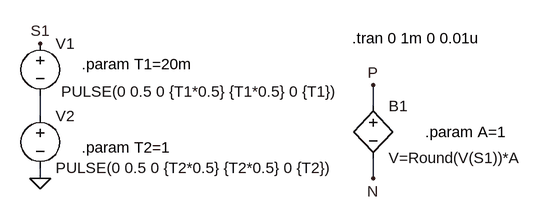
[diagram p0: schematic PWM.asc]
PWM.asc, the LTspice schematic file:
Version 4
SHEET 1 1044 680
WIRE 512 128 512 96
WIRE 0 144 0 112
WIRE 0 240 0 224
WIRE 512 240 512 208
FLAG 0 32 S1
FLAG 512 96 P
FLAG 512 240 N
FLAG 0 240 0
SYMBOL bv 512 112 R0
SYMATTR InstName B1
SYMATTR Value V=Round(V(S1))*A
SYMBOL voltage 0 16 R0
WINDOW 3 32 90 Left 0
WINDOW 123 0 0 Left 0
WINDOW 39 0 0 Left 0
SYMATTR Value PULSE(0 0.5 0 {T1*0.5} {T1*0.5} 0 {T1})
SYMATTR InstName V1
SYMBOL voltage 0 128 R0
WINDOW 123 0 0 Left 0
WINDOW 39 0 0 Left 0
SYMATTR InstName V2
SYMATTR Value PULSE(0 0.5 0 {T2*0.5} {T2*0.5} 0 {T2})
TEXT 64 64 Left 0 !.param T1=20m
TEXT 64 192 Left 0 !.param T2=1
TEXT 480 24 Left 0 !.tran 0 1m 0 0.01u
TEXT 592 168 Left 0 !.param A=1

The netlist it stands for:
* PWM.asc
B1 P N V=Round(V(S1))*A
V1 S1 N001 PULSE(0 0.5 0 {T1*0.5} {T1*0.5} 0 {T1})
V2 N001 0 PULSE(0 0.5 0 {T2*0.5} {T2*0.5} 0 {T2})
.param T1=20m
.param T2=1
.tran 0 1m 0 0.01u
.param A=1
.backanno
.end